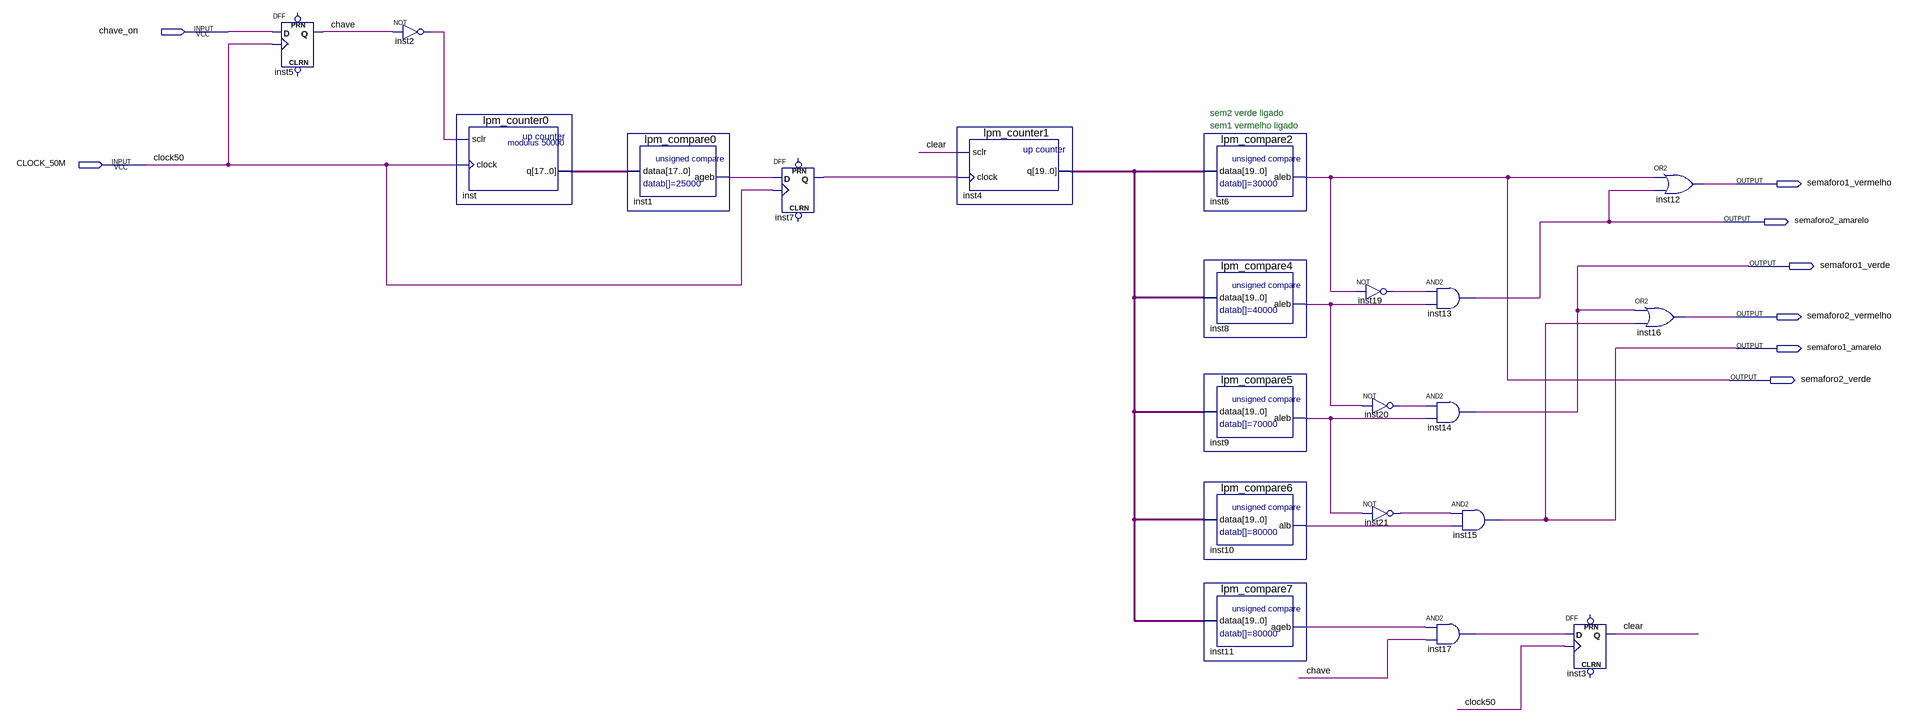
[diagram p0: schematic sheet]
// Quartus schematic ProjetoFinalSD_Semaforos.bdf as structural Verilog: 21 symbols, 8 pins
module ProjetoFinalSD_Semaforos (
  input  chave_on,
  input  CLOCK_50M,
  output semaforo1_vermelho,
  output semaforo2_amarelo,
  output semaforo1_verde,
  output semaforo2_vermelho,
  output semaforo1_amarelo,
  output semaforo2_verde
);

  wire chave, clear, inst1_ageb, inst2_out, inst7_q, inst8_aleb, inst9_aleb, inst10_alb, inst11_ageb,
       inst17_out, inst19_out, inst20_out, inst21_out;
  wire [17:0] inst_q;
  wire [19:0] inst4_q;

  DFF inst5 (.CLK(CLOCK_50M), .D(chave_on), .Q(chave));  // open: CLRN, PRN
  not inst2 (inst2_out, chave);
  lpm_counter0 inst (.sclr(inst2_out), .clock(CLOCK_50M), .q(inst_q));
  lpm_compare0 inst1 (.dataa(inst_q), .ageb(inst1_ageb));
  DFF inst7 (.CLK(CLOCK_50M), .D(inst1_ageb), .Q(inst7_q));  // open: CLRN, PRN
  lpm_counter1 inst4 (.sclr(clear), .clock(inst7_q), .q(inst4_q));
  lpm_compare2 inst6 (.dataa(inst4_q), .aleb(semaforo2_verde));
  lpm_compare4 inst8 (.dataa(inst4_q), .aleb(inst8_aleb));
  lpm_compare5 inst9 (.dataa(inst4_q), .aleb(inst9_aleb));
  lpm_compare6 inst10 (.dataa(inst4_q), .alb(inst10_alb));
  lpm_compare7 inst11 (.dataa(inst4_q), .ageb(inst11_ageb));
  not inst19 (inst19_out, semaforo2_verde);
  not inst20 (inst20_out, inst8_aleb);
  not inst21 (inst21_out, inst9_aleb);
  and inst13 (semaforo2_amarelo, inst19_out, inst8_aleb);
  and inst14 (semaforo1_verde, inst20_out, inst9_aleb);
  and inst15 (semaforo1_amarelo, inst21_out, inst10_alb);
  and inst17 (inst17_out, inst11_ageb, chave);
  DFF inst3 (.CLK(CLOCK_50M), .D(inst17_out), .Q(clear));  // open: CLRN, PRN
  or inst12 (semaforo1_vermelho, semaforo2_verde, semaforo2_amarelo);
  or inst16 (semaforo2_vermelho, semaforo1_verde, semaforo1_amarelo);

  // Other names for the same wires on the sheet: clock50 = CLOCK_50M

  // Notes on the sheet:
  //   sem2 verde ligado
  //   sem1 vermelho ligado 
endmodule
